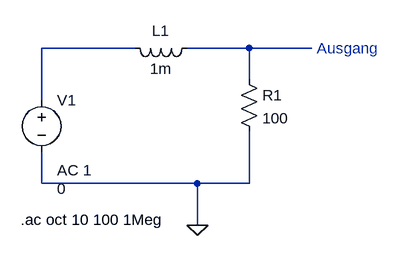
[diagram p0: schematic Beispielschaltung2.asc]
Beispielschaltung2.asc, the LTspice schematic file:
Version 4
SHEET 1 880 680
WIRE 96 -16 -48 -16
WIRE 272 -16 176 -16
WIRE 368 -16 272 -16
WIRE 272 32 272 -16
WIRE -48 64 -48 -16
WIRE -48 192 -48 144
WIRE 192 192 -48 192
WIRE 272 192 272 112
WIRE 272 192 192 192
WIRE 192 256 192 192
FLAG 192 256 0
SYMBOL voltage -48 48 R0
WINDOW 3 24 152 Left 2
WINDOW 123 24 124 Left 2
WINDOW 39 0 0 Left 2
SYMATTR Value 0
SYMATTR Value2 AC 1
SYMATTR InstName V1
SYMBOL res 256 16 R0
SYMATTR InstName R1
SYMATTR Value 100
SYMBOL ind 192 -32 R90
WINDOW 0 5 56 VBottom 2
WINDOW 3 32 56 VTop 2
SYMATTR InstName L1
SYMATTR Value 1m
TEXT 376 -16 Left 2 ;Ausgang
TEXT -80 248 Left 2 !.ac oct 10 100 1Meg

The netlist it stands for:
* Beispielschaltung2.asc
V1 N001 0 0 AC 1
R1 N002 0 100
L1 N002 N001 1m
* Ausgang
.ac oct 10 100 1Meg
.backanno
.end